# EAGLE design ZamekUSBC (EAGLE 9.5.2)
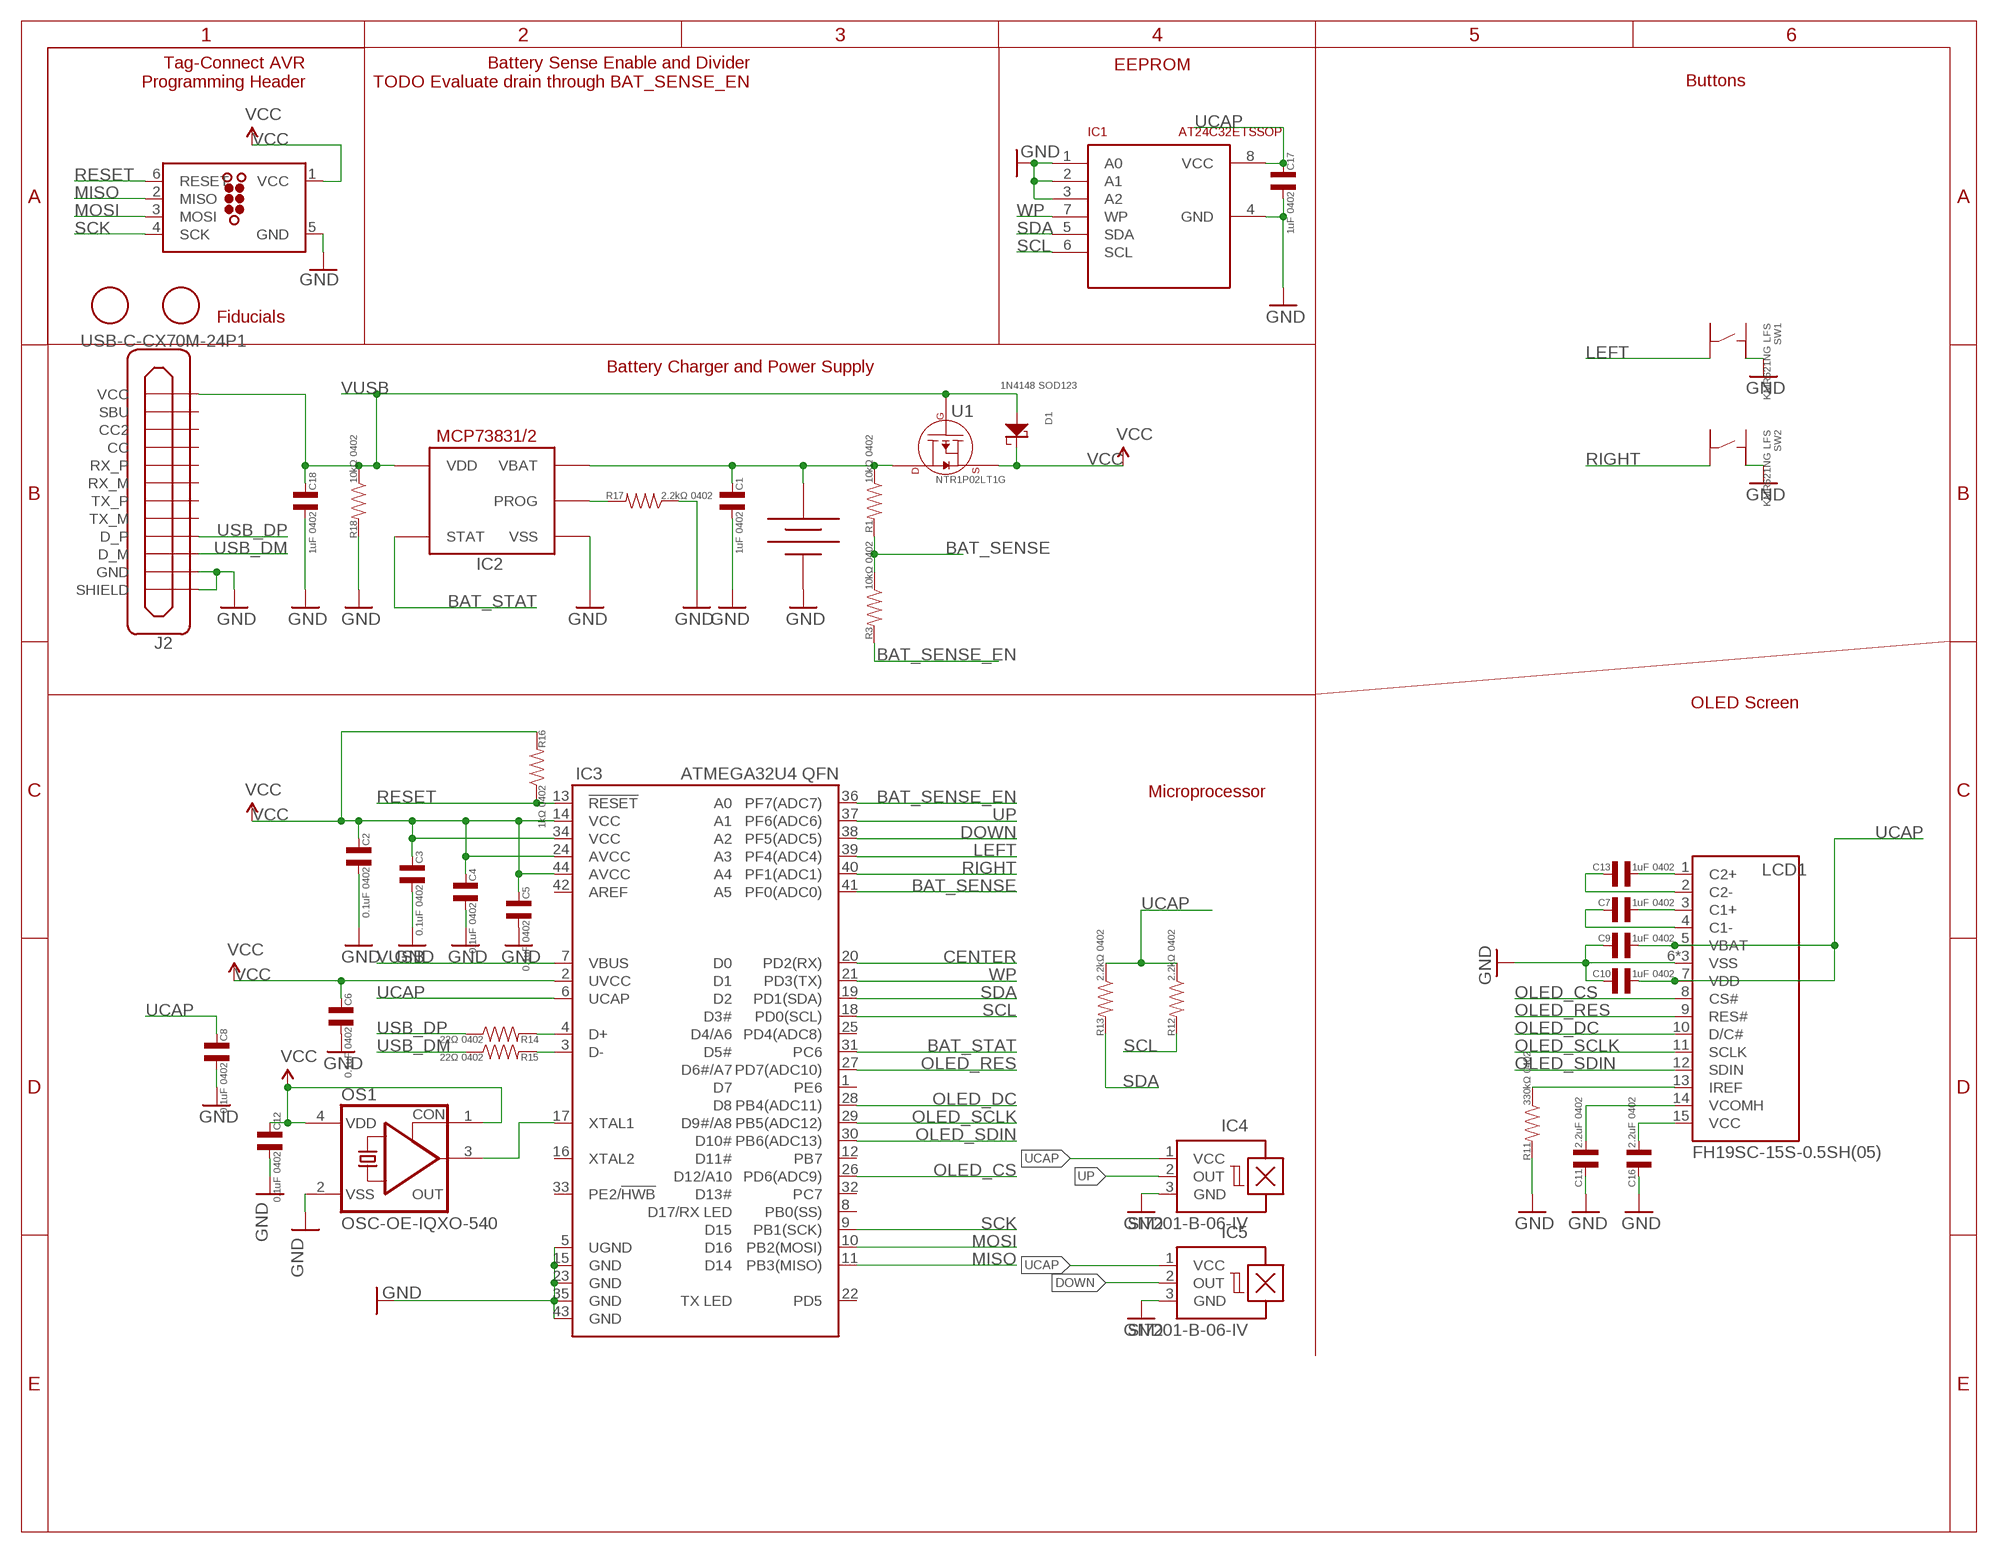
[diagram p0: schematic, sheet 1]

## Parts
BAT1  LIPO201030  [201030LIPO]
C1  1uF 0402  CAPACITOR_NP_0402  [C0402]
C2  0.1uF 0402  CAPACITOR_NP_0402  [C0402]
C3  0.1uF 0402  CAPACITOR_NP_0402  [C0402]
C4  0.1uF 0402  CAPACITOR_NP_0402  [C0402]
C5  0.1uF 0402  CAPACITOR_NP_0402  [C0402]
C6  0.1uF 0402  CAPACITOR_NP_0402  [C0402]
C7  1uF 0402  CAPACITOR_NP_0402  [C0402]
C8  0.1uF 0402  CAPACITOR_NP_0402  [C0402]
C9  1uF 0402  CAPACITOR_NP_0402  [C0402]
C10  1uF 0402  CAPACITOR_NP_0402  [C0402]
C11  2.2uF 0402  CAPACITOR_NP_0402  [C0402]
C12  0.1uF 0402  CAPACITOR_NP_0402  [C0402]
C13  1uF 0402  CAPACITOR_NP_0402  [C0402]
C16  2.2uF 0402  CAPACITOR_NP_0402  [C0402]
C17  1uF 0402  CAPACITOR_NP_0402  [C0402]
C18  1uF 0402  CAPACITOR_NP_0402  [C0402]
D1  1N4148 SOD123  DIODES_SOD-123  [SOD-123]
IC1  AT24C32ETSSOP  [TSSOP8-W]
IC2  MCP73831  MCP73831MF  [MFSOT23-5L]
IC3  ATMEGA32U4 QFN  ATMEGA32U4QFN2  [QFN-44-NOPAD]
IC4  SI7201-B-06-IV  A1202LH  [SOT23-W]
IC5  SI7201-B-06-IV  A1202LH  [SOT23-W]
J1  TC2030-MCP-NLFIX  [TC2030-MCP-NL]
J2  USB-C-CX70M-24P1  [CX70M-24P1]
LCD1  FH19SC-15S-0.5SH(05)  MICROBUILDER_OLED_UG-2832HSWEG04  [ER-OLED0.91-3WWFH19C]
OS1  OSC-OE-IQXO-540  [2.0X1.6-4-PAD]
Q1  FIDUCIAL  [FIDUCIAL_1MM]
Q2  FIDUCIAL  [FIDUCIAL_1MM]
R1  10kΩ 0402  RESISTOR_0402  [R0402]
R3  10kΩ 0402  RESISTOR_0402  [R0402]
R11  330kΩ 0402  RESISTOR_0402  [R0402]
R12  2.2kΩ 0402  RESISTOR_0402  [R0402]
R13  2.2kΩ 0402  RESISTOR_0402  [R0402]
R14  22Ω 0402  RESISTOR_0402  [R0402]
R15  22Ω 0402  RESISTOR_0402  [R0402]
R16  1kΩ 0402  RESISTOR_0402  [R0402]
R17  2.2kΩ 0402  RESISTOR_0402  [R0402]
R18  10kΩ 0402  RESISTOR_0402  [R0402]
SW1  KMR621NG LFS  TACT_4.2MM  [TACT4.2MM]
SW2  KMR621NG LFS  TACT_4.2MM  [TACT4.2MM]
U1  NTR1P02LT1G  P-CHANNEL_FET_SOT-23-3  [SOT-23-3]

## Nets
BAT_SENSE: IC3.41(PF0(ADC0)) R1.P$2 R3.P$1
BAT_SENSE_EN [power]: IC3.36(PF7(ADC7)) R3.P$2
BAT_STAT: IC2.P$1(STAT) IC3.31(PC6)
CENTER: IC3.20(PD2(RX))
DOWN: IC3.38(PF5(ADC5)) IC5.2(OUT)
GND [power]: BAT1.NEG C1.P$1 C2.P$1 C3.P$1 C4.P$1 C5.P$1 C6.P$1 C8.P$1 C9.P$2 C10.P$2 C11.P$2 C12.P$1 C16.P$2 C17.P$1 C18.P$1 IC1.1(A0) IC1.2(A1) IC1.3(A2) IC1.4(GND) IC2.P$2(VSS) IC3.5(UGND) IC3.15(GND) IC3.23(GND) IC3.35(GND) IC3.43(GND) IC4.3(GND) IC5.3(GND) J1.5(GND) J2.A1(GND) J2.A12(GND) J2.B1(GND) J2.B12(GND) J2.SHIELD@1(SHIELD) J2.SHIELD@2(SHIELD) J2.SHIELD@3(SHIELD) J2.SHIELD@4(SHIELD) LCD1.6(VSS) LCD1.EP1(VSS) LCD1.EP2(VSS) OS1.2(VSS) R11.P$2 R17.P$1 R18.P$2 SW1.P$2 SW2.P$2
LEFT: IC3.39(PF4(ADC4)) SW1.P$4
MISO: IC3.11(PB3(MISO)) J1.2(MISO)
MOSI: IC3.10(PB2(MOSI)) J1.3(MOSI)
N$1: C13.P$2 LCD1.2(C2-)
N$2: C7.P$1 LCD1.3(C1+)
N$3: C7.P$2 LCD1.4(C1-)
N$4: C13.P$1 LCD1.1(C2+)
N$5: IC2.P$5(PROG) R17.P$2
N$6: IC3.4(D+) R14.P$2
N$7: IC3.17(XTAL1) OS1.3(OUT)
N$8: LCD1.13(IREF) R11.P$1
N$9: C11.P$1 LCD1.14(VCOMH)
N$10: IC3.3(D-) R15.P$2
N$15: C16.P$1 LCD1.15(VCC)
OLED_CS: IC3.26(PD6(ADC9)) LCD1.8(CS#)
OLED_DC: IC3.28(PB4(ADC11)) LCD1.10(D/C#)
OLED_RES: IC3.27(PD7(ADC10)) LCD1.9(RES#)
OLED_SCLK: IC3.29(PB5(ADC12)) LCD1.11(SCLK)
OLED_SDIN: IC3.30(PB6(ADC13)) LCD1.12(SDIN)
RESET: IC3.13(!RESET) J1.6(RESET) R16.P$1
RIGHT: IC3.40(PF1(ADC1)) SW2.P$4
SCK: IC3.9(PB1(SCK)) J1.4(SCK)
SCL: IC1.6(SCL) IC3.18(PD0(SCL)) R12.P$2
SDA: IC1.5(SDA) IC3.19(PD1(SDA)) R13.P$2
UCAP [power]: C8.P$2 C9.P$1 C10.P$1 C17.P$2 IC1.8(VCC) IC3.6(UCAP) IC4.1(VCC) IC5.1(VCC) LCD1.5(VBAT) LCD1.7(VDD) R12.P$1 R13.P$1
UP: IC3.37(PF6(ADC6)) IC4.2(OUT)
USB_DM: J2.A7(D_M) J2.B7(D_M) R15.P$1
USB_DP: J2.A6(D_P) J2.B6(D_P) R14.P$1
VBAT [power]: BAT1.POS C1.P$2 IC2.P$3(VBAT) R1.P$1 U1.P$3(DRAIN)
VCC [power]: C2.P$2 C3.P$2 C4.P$2 C5.P$2 C6.P$2 C12.P$2 D1.CATHODE IC3.2(UVCC) IC3.14(VCC) IC3.24(AVCC) IC3.34(VCC) IC3.44(AVCC) J1.1(VCC) OS1.1(CON) OS1.4(VDD) R16.P$2 U1.P$2(SOURCE)
VUSB [power]: C18.P$2 D1.ANODE IC2.P$4(VDD) IC3.7(VBUS) J2.A4(VCC) J2.A9(VCC) J2.B4(VCC) J2.B9(VCC) R18.P$1 U1.P$1(GATE)
WP: IC1.7(WP) IC3.21(PD3(TX))
Unconnected: IC3.1(PE6) IC3.8(PB0(SS)) IC3.12(PB7) IC3.16(XTAL2) IC3.22(PD5) IC3.25(PD4(ADC8)) IC3.32(PC7) IC3.33(PE2/!HWB) IC3.42(AREF) J2.A2(TX_P) J2.A3(TX_M) J2.A5(CC) J2.A8(SBU) J2.A10(RX_M) J2.A11(RX_P) J2.B2(TX_P) J2.B3(TX_M) J2.B5(CC2) J2.B8(SBU) J2.B10(RX_M) J2.B11(RX_P) SW1.P$1 SW1.P$3 SW2.P$1 SW2.P$3

## Notes on the sheet
- Tag-Connect AVR
  Programming Header
- Battery Sense Enable and Divider
  TODO Evaluate drain through BAT_SENSE_EN
- EEPROM
- Buttons
- Fiducials
- Battery Charger and Power Supply
- OLED Screen
- Microprocessor

## Library data of the parts
BAT1 = sonik:LIPO201030
C1-C13 C16-C18 = MF_Passives:CAPACITOR_NP: Library: MF_Passives Description: Device for Non-Polarized Capacitors. Manufacture part number (MPN) can be added via Attributes. Check https://factory.macrofab.com/parts for the house parts list.; POPULATE: 1
D1 = MF_Discrete_Semiconductor:DIODES: Library: MF_Discrete_Semiconductor Description: Device for Single Packaged Diodes.; HOUSEPART: NO; POPULATE: 1
IC1 = sonik:AT24C32E
IC2 = adafruit:MCP73831: MCP73831/2 Miniature Single-Cell, Fully Integrated Li-Ion, Li-Polymer Charge Management Controllers. Nice and small simple lipoly charge controller, with adjustable current and status output (LED) http://www.ladyada.net/library/pcb/eaglelibrary.html
IC3 = SparkFun-DigitalIC:ATMEGA32U4: Atmel 44-pin 8-bit Microcontroller with 32KBytes of ISP Flash and USB Controller
IC4 IC5 = allegro:A12*?: Hall-effect bipolar switch Source: http://www.allegromicro.com/en/Products/Part_Numbers/1202/1202.pdf; OC_FARNELL: unknown; OC_NEWARK: unknown
J1 = sonik:TC2030: TAG-CONNECT ICSP Connector Manufacturer: Tag-Connect <http://www.tag-connect.com> Cable for easy In-Circuit Serial Programming. Designed for Microchip ICD2, suitable for many others. Two variants - one "with legs" (for hands-free fit on PCB) and another "without legs" for quick programming. PAD Description 1 MCLR/Vpp 2 Vdd 3 GND 4 PGD (ISPDAT) 5 PGC (ISPCLK) 6 nc (used for LVP) ©2009 ROFA.cz - modified and updated by Robert Darlington ‹rdarlington@gmail.com›
J2 = USB:USB-C
LCD1 = sonik:MICROBUILDER_OLED_UG-2832HSWEG04: 128x32 SPI 0.91" Monochrome OLED Display
OS1 = IQD-Frequency-Products:OSC-OE: OSCILLATOR WITH OE
Q1 Q2 = adafruit:FIDUCIAL: For use by pick and place machines to calibrate the vision/machine, 1mm By microbuilder.eu
R1 R3 R11-R18 = MF_Passives:RESISTOR: Library: MF_Passives Description: Device for Resistors. Manufacture part number (MPN), Voltage, Tolerance, and Wattage Rating can be added via Attributes. Check https://factory.macrofab.com/parts for the house parts list.; POPULATE: 1
SW1 SW2 = MF_Switches:TACT: Library: MF_Switches Description: Device for Tact Switches. Manufacture part number (MFG#) can be added via Attributes.; HOUSEPART: YES; MPN: MF-SW-TACT-4.2MM; POPULATE: 1; URL: https://factory.macrofab.com/part/MF-SW-TACT-4.2MM; VALUE: MF-SW-TACT-4.2MM
U1 = MF_Discrete_Semiconductor:P-CHANNEL_FET: Library: MF_Discrete_Semiconductor Description: Device for Single P-Channel Mosfet. Manufacture part number (MFG#) can be added via Attributes.; HOUSEPART: NO; POPULATE: 1

## Board
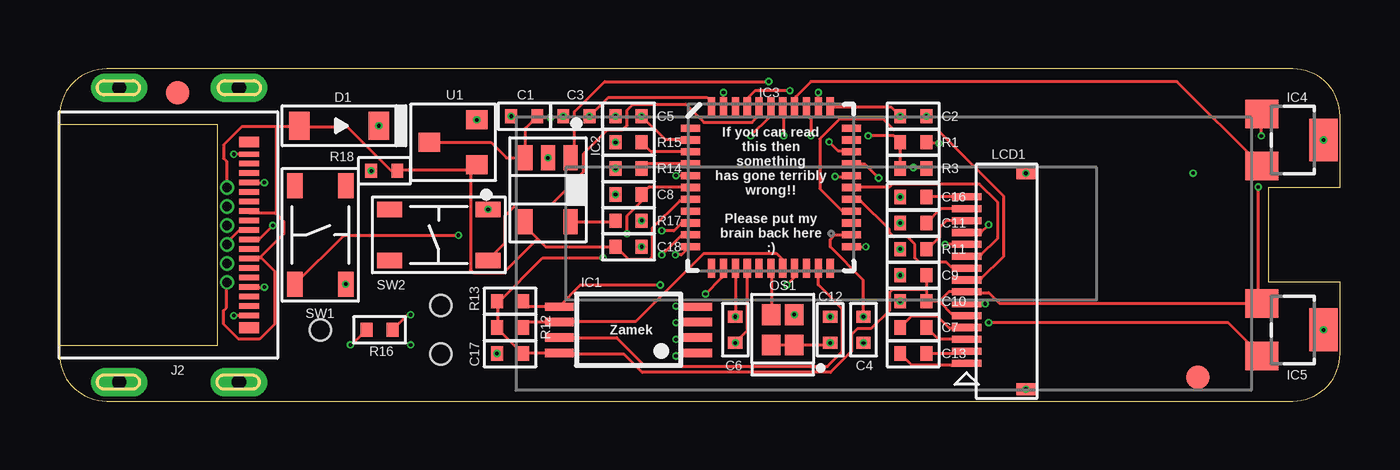
[diagram p1: board, top side]
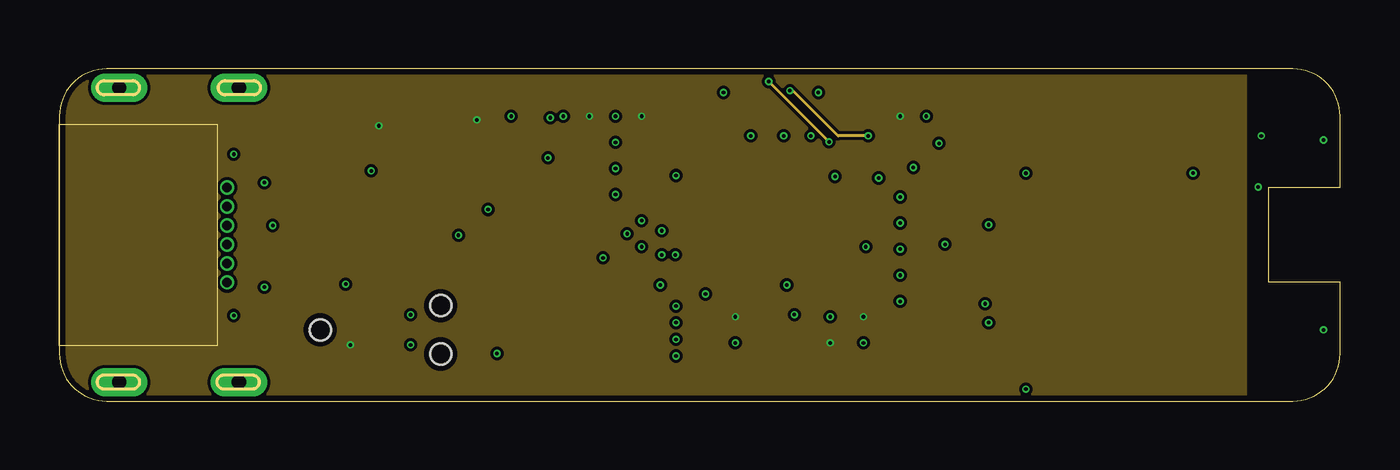
[diagram p2: board, inner layer VCC]
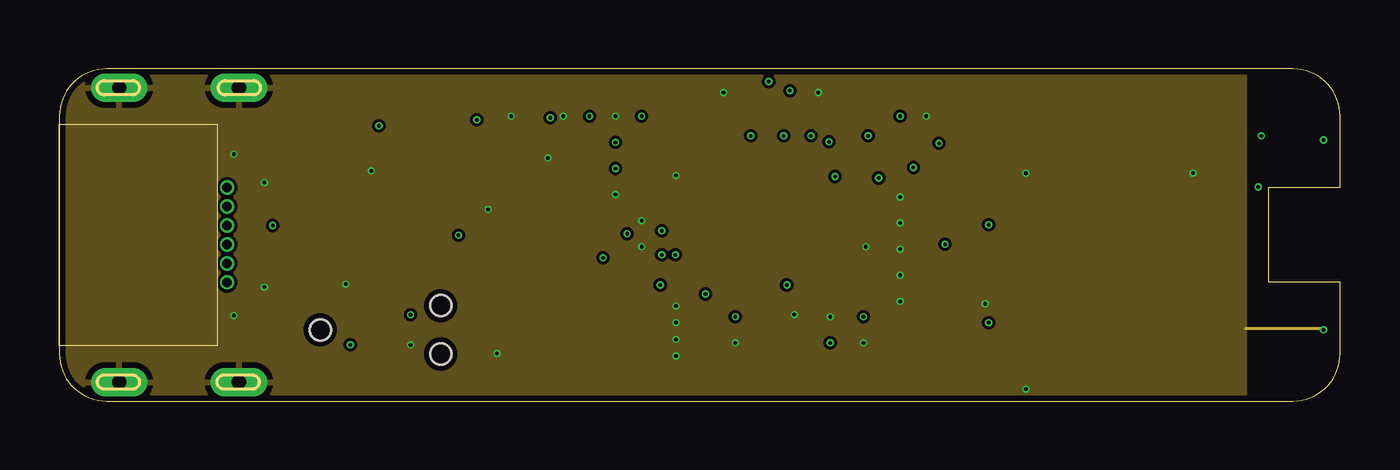
[diagram p3: board, inner layer GND]
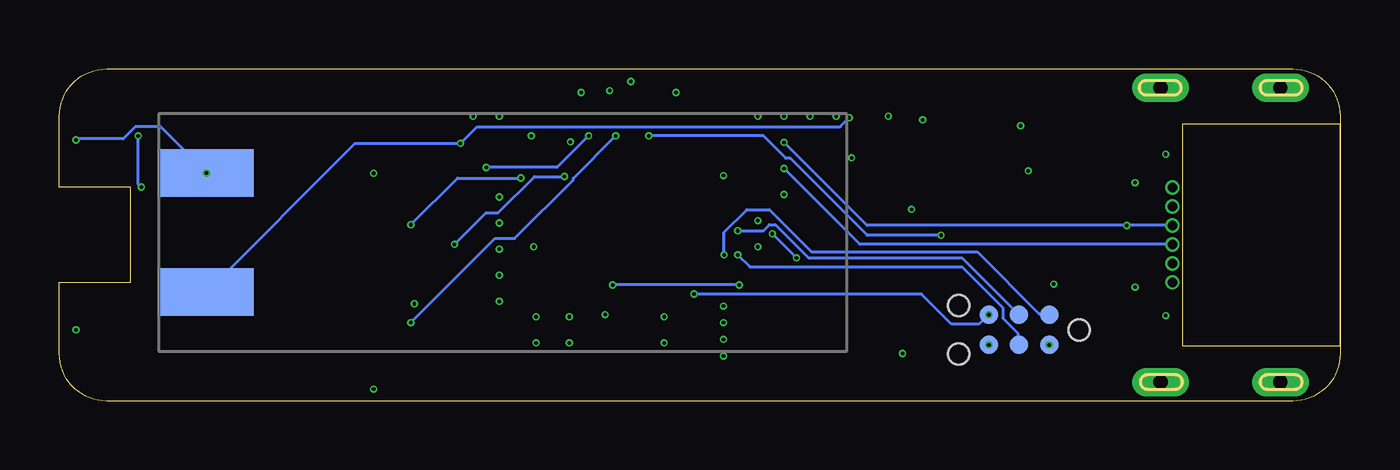
[diagram p4: board, bottom side, seen from below]

Size 54 x 14 mm. Coordinates in mm from the lower left corner, seen from the top.
Outline: 52,14 2,14 arc90 0,12 0,2 arc90 2,0 52,0 arc90 54,2 54,5 51,5 51,9 54,9 54,12 arc90 52,14
Copper layers (1*2*15*16): Top 0.035mm / dielectric 0.23mm / VCC 0.035mm / dielectric 0.93mm / GND 0.035mm / dielectric 0.23mm / Bottom 0.035mm
Design rules "MF_Standard_4_Layer *": minimum track width 5mil, minimum drill 0.15mm, track to track 5mil, track to pad 5mil, pad to pad 5mil, via to via 5mil, smd to smd 0mil, copper to edge 10mil, drill to drill 10mil, minimum pad ring 3mil, minimum via ring 3mil, stop-mask expansion 2mil, vias tented up to drill 25mil, thermal gap 10mil

### Footprints (pad centres in the part's own frame; a part is rotated, then mirrored left to right if it is on the bottom)
201030LIPO = smd 4 x 2: NEG 14,-2.5; POS 14,2.5
C0402 = smd 0.6 x 0.5: P$1 0,-0.55; P$2 0,0.55
SOD-123 = smd 0.85 x 1.2: ANODE 1.675,0; CATHODE -1.675,0
TSSOP8-W = smd 1.2 x 0.35: 1 -2.925,0.975; 2 -2.925,0.325; 3 -2.925,-0.325; 4 -2.925,-0.975; 5 2.925,-0.975; 6 2.925,-0.325; 7 2.925,0.325; 8 2.925,0.975
MFSOT23-5L = smd 1.05 x 0.6: P$1 -1.35,0.95; P$2 -1.35,0; P$3 -1.35,-0.95; P$4 1.35,-0.95; P$5 1.35,0.95
QFN-44-NOPAD = smd 0.8 x 0.3: 1 -3.4,2.5; 2 -3.4,2; 3 -3.4,1.5; 4 -3.4,1; 5 -3.4,0.5; 6 -3.4,0; 7 -3.4,-0.5; 8 -3.4,-1; 9 -3.4,-1.5; 10 -3.4,-2; 11 -3.4,-2.5; 23 3.4,-2.5; 24 3.4,-2; 25 3.4,-1.5; 26 3.4,-1; 27 3.4,-0.5; 28 3.4,0; 29 3.4,0.5; 30 3.4,1; 31 3.4,1.5; 32 3.4,2; 33 3.4,2.5 | smd 0.3 x 0.8: 12 -2.5,-3.4; 13 -2,-3.4; 14 -1.5,-3.4; 15 -1,-3.4; 16 -0.5,-3.4; 17 0,-3.4; 18 0.5,-3.4; 19 1,-3.4; 20 1.5,-3.4; 21 2,-3.4; 22 2.5,-3.4; 34 2.5,3.4; 35 2,3.4; 36 1.5,3.4; 37 1,3.4; 38 0.5,3.4; 39 0,3.4; 40 -0.5,3.4; 41 -1,3.4; 42 -1.5,3.4; 43 -2,3.4; 44 -2.5,3.4
SOT23-W = smd 1.2 x 1.4: 1 -1.1,-1.3; 2 1.1,-1.3 | smd 1.8 x 1.2: 3 0,1.3
TC2030-MCP-NL = smd 0.787 x 0.787: 1 4.73,-0.635; 2 4.73,0.635; 3 3.46,-0.635; 4 3.46,0.635; 5 2.19,-0.635; 6 2.19,0.635 | hole 0.889: 6,0; 0.92,-1.016; 0.92,1.016
CX70M-24P1 = smd 0.23 x 0.85: A1 2.2,-8; A2 1.8,-8; A3 1.4,-8; A4 1,-8; A5 0.6,-8; A6 0.2,-8; A7 -0.2,-8; A8 -0.6,-8; A9 -1,-8; A10 -1.4,-8; A11 -1.8,-8; A12 -2.2,-8; B1 -3.4,-8; B2 -3,-8; B3 -2.6,-8; B10 2.6,-8; B11 3,-8; B12 3.4,-8 | drill 0.4 pad 0.6: B4 -2,-7.075; B5 -1.2,-7.075; B6 -0.4,-7.075; B7 0.4,-7.075; B8 1.2,-7.075; B9 2,-7.075 | smd 0.46 x 0.85: NC@1 -3.915,-8; NC@2 3.915,-8 | drill 0.6 pad 1.2 long: SHIELD@1 6.2,-7.575; SHIELD@2 -6.2,-7.575; SHIELD@3 6.2,-2.525; SHIELD@4 -6.2,-2.525
ER-OLED0.91-3WWFH19C = smd 1.25 x 0.3: 1 3.5,-4.602; 2 3.5,-4.102; 3 3.5,-3.602; 4 3.5,-3.102; 5 3.5,-2.602; 6 3.5,-2.102; 7 3.5,-1.602; 8 3.5,-1.102; 9 3.5,-0.602; 10 3.5,-0.102; 11 3.5,0.402; 12 3.5,0.902; 13 3.5,1.402; 14 3.5,1.902; 15 3.5,2.402 | smd 0.8 x 0.5: EP1 6,3.398; EP2 6,-5.702
2.0X1.6-4-PAD = smd 0.875 x 0.775: 1 -0.637,-0.487; 2 0.637,-0.487; 3 0.637,0.487; 4 -0.637,0.487
FIDUCIAL_1MM = smd 1 x 1: 1 0,0
R0402 = smd 0.5 x 0.6: P$1 -0.55,0; P$2 0.55,0
TACT4.2MM = smd 1.05 x 0.65: P$1 -2.075,1.075; P$2 2.075,1.075; P$3 -2.075,-1.075; P$4 2.075,-1.075
SOT-23-3 = smd 0.9 x 0.8: P$1 -1,0.95; P$2 -1,-0.95; P$3 1,0

### Placement (x,y rotation side)
BAT1  33.8,7.1 180 bottom
C1  19.6,12 270 top
C2  36,12 90 top
C3  21.8,12 270 top
C4  33.9,3 0 top
C5  24,12 270 top
C6  28.5,3 0 top
C7  36,3.1 90 top
C8  24,8.7 270 top
C9  36,5.3 90 top
C10  36,4.2 90 top
C11  36,7.5 90 top
C12  32.5,3 180 top
C13  36,2 270 top
C16  36,8.6 90 top
C17  19,2 270 top
C18  24,6.5 90 top
D1  11.8,11.6 180 top
IC1  24,3 180 top
IC2  20.6,8.9 270 top
IC3  30,9 0 top
IC4  52,11 270 top
IC5  52,3 270 top
J1  17,3 0 bottom
J2  0,7 90 top
LCD1  34.75,6.2 0 top
OS1  30.5,3 90 top
Q1  5,13 0 top
Q2  48,1 0 top
R1  36,10.9 180 top
R3  36,9.8 0 top
R11  36,6.4 180 top
R12  19,3.1 0 top
R13  19,4.2 0 top
R14  24,9.8 0 top
R15  24,10.9 0 top
R16  13.5,3 180 top
R17  24,7.6 180 top
R18  13.7,9.7 180 top
SW1  11,7 270 top
SW2  16,7 0 top
U1  16.6,10.9 180 top

### Tracks (layer width: path | path; a pad name or v marks a point on that pad's centre or on a via)
BAT_SENSE  (via drill 0.15)
  Top 0.127: v30.8,13.08 29.34,13.08 29.02,12.76 29.02,12.45 IC3.41 | v34.1,11.18 35.18,11.18 35.43,10.92 R1.P$2
  Top 0.13: R3.P$1 R1.P$2
  VCC 0.127: v30.8,13.08 30.92,13.08 32.83,11.18 v34.1,11.18
BAT_SENSE_EN  (via drill 0.15)
  Top 0.127: v36.01,9.84 36.51,9.84 R3.P$2 | v31.69,11.18 31.69,11.87 31.56,12 31.56,12.38 IC3.36
  Bottom 0.127: v36.01,9.84 33.02,9.84 v31.69,11.18
BAT_STAT  (via drill 0.15)
  Top 0.127: v32.45,10.92 32.83,10.54 33.34,10.54 IC3.31 | v29.91,13.46 22.99,13.46 21.72,12.19 21.72,10.41 21.59,10.29 IC2.P$1
  VCC 0.127: v29.91,13.46 v32.45,10.92
DOWN  (via drill 0.15)
  Top 0.127: v30.54,11.18 30.54,12.38 IC3.38 | v39.18,3.3 49.28,3.3 50.67,1.91 IC5.2
  Bottom 0.127: v30.54,11.18 32.32,9.4 32.32,9.34 34.8,6.86 35.62,6.86 v39.18,3.3
GND  (via drill 0.15)
  Top 0.127: IC3.15 29.02,5.59 29.02,2.98 28.51,2.48 C6.P$1
  Top 0.13: IC3.43 v28,13 | IC3.35 v32,13 | LCD1.6 v39.03,4.1 | IC3.23 v34,6.5 | IC1.4 26.9,4 v26,4 | IC1.3 26.02,3.33 v26,3.3 | IC1.2 26.07,2.67 v26,2.6 | IC1.1 26.12,2.02 v26,1.9 | IC3.5 v26,9.5 | J2.B1 v7.36,3.6 | J2.A12 v8.64,4.8 | J2.A1 v8.64,9.2 | J2.B12 v7.36,10.4
  GND 0.127: 50,3.05 50.04,3.05 53.28,3.05 IC5.3
  Bottom 0.127: IC4.3 53.28,11.05 51.31,11.05 50.8,11.56 49.72,11.56 47.82,9.65 BAT1.NEG
  other vias: 14.81,2.37 12.07,4.92 18.07,8.07 13.15,9.7 19.05,12 20.6,10.25 21.25,12 23.45,12 35.45,7.5 35.45,8.6 35.45,6.4 35.45,5.3 35.45,4.2 36.55,12 40.75,9.6 40.75,0.5 47.8,9.6 53.3,11 53.3,3 33.9,2.45 32.5,3.55 30.99,3.64 28.5,2.45 18.45,2 24.55,6.5 24.55,7.6 23.45,8.7
  pour GND: 0,14 50,14 50,0 0,0
LEFT  (via drill 0.15)
  Top 0.127: v29.15,11.18 29.97,12 29.97,12.38 IC3.39 | v16.83,6.99 12,6.99 9.97,4.95 SW1.P$4
  Bottom 0.127: v29.15,11.18 24.32,11.18 23.37,10.22 23.18,10.22 19.94,6.99 v16.83,6.99
MISO  (via drill 0.15)
  Top 0.127: v25.97,6.16 26.23,6.16 26.54,6.48 IC3.11
  Bottom 0.127: v25.97,6.16 25.97,7.11 25.02,8.06 24.07,8.06 22.29,6.29 15.3,6.29 12.7,3.68 12.32,3.68 J1.2
MOSI  (via drill 0.15)
  Top 0.127: v25.4,6.16 26.23,6.99 26.54,6.99 IC3.10
  Bottom 0.127: v25.4,6.16 24.89,5.65 15.94,5.65 14.22,3.94 14.22,3.49 13.59,2.86 13.59,2.41 J1.3
N$1
  Top 0.13: LCD1.2 38.15,2 C13.P$2
N$2
  Top 0.13: LCD1.3 37.05,2.6 C7.P$1
N$3
  Top 0.13: C7.P$2 35.95,3.6 37,3.6 37.5,3.1 LCD1.4
N$4
  Top 0.13: LCD1.1 37.7,1.6 37.6,1.5 35.95,1.5 C13.P$1
N$5
  Top 0.127: R17.P$2 23.43,7.56 21.59,7.56 IC2.P$5
N$6
  Top 0.13: IC3.4 24.75,10 R14.P$2
N$7
  Top 0.127: IC3.17 30.04,5.59 30.04,3.68 OS1.3
N$8
  Top 0.13: LCD1.13 37.4,7.6 37.1,7.3 37.1,6.9 36.6,6.4 R11.P$1
N$9
  Top 0.13: LCD1.14 37.15,8.1 C11.P$1
N$10
  Top 0.13: IC3.3 24.95,10.5 R15.P$2
N$15
  Top 0.13: LCD1.15 C16.P$1
OLED_CS
  Top 0.127: IC3.26 33.34,8 33.02,8 32.07,8.95 32.07,11.05 32.89,11.87 34.73,11.87 35.18,11.43 37.02,11.43 39.81,8.64 39.81,6.1 38.86,5.14 38.29,5.14 LCD1.8
OLED_DC
  Top 0.127: IC3.28 33.4,9.02 34.99,9.02 35.12,9.14 38.8,9.14 39.56,8.38 39.56,6.86 38.86,6.16 38.29,6.16 LCD1.10
OLED_RES
  Top 0.127: IC3.27 33.4,8.45 33.78,8.45 34.99,7.24 34.99,7.11 35.18,6.92 35.75,6.92 36.07,6.6 36.07,6.03 36.26,5.84 37.4,5.84 37.59,5.65 38.23,5.65 LCD1.9
OLED_SCLK  (via drill 0.15)
  Top 0.127: v32.7,9.46 33.34,9.46 IC3.29 | v37.34,6.6 38.23,6.6 LCD1.11
  Bottom 0.127: v32.7,9.46 33.97,9.46 35.5,7.94 36.01,7.94 v37.34,6.6
OLED_SDIN  (via drill 0.15)
  Top 0.127: v34.54,9.4 33.97,9.97 33.4,9.97 IC3.30 | v39.18,7.43 38.86,7.11 38.29,7.11 LCD1.12
  Bottom 0.127: v34.54,9.4 37.21,9.4 v39.18,7.43
RESET  (via drill 0.15)
  Top 0.127: v27.24,4.51 27.94,5.21 27.94,5.59 IC3.13
  Top 0.13: J1.6 14.69,3.63 R16.P$1
  Bottom 0.127: v27.24,4.51 17.65,4.51 16.38,3.24 15.24,3.24 14.86,3.62 J1.6
  other vias: 14.81,3.63
RIGHT
  Top 0.127: IC3.40 29.46,12.38 29.46,12 29.21,11.75 27.18,11.75 26.42,12.51 24.19,12.51 23.94,12.26 23.94,11.62 23.75,11.43 23.11,11.43 22.1,10.41 22.1,9.65 20.77,8.32 19.3,8.32 18.8,7.81 18.8,6.67 18.1,5.97 SW2.P$4
SCK  (via drill 0.15)
  Top 0.127: v25.4,7.18 25.91,7.18 26.23,7.49 26.54,7.49 IC3.9
  Bottom 0.127: v25.4,7.18 24.32,7.18 24.07,7.43 23.81,7.43 22.42,6.03 15.94,6.03 13.59,3.68 J1.4
SCL
  Top 0.127: IC3.18 30.48,5.65 30.48,5.97 30.23,6.22 27.18,6.22 24.32,3.37 21.08,3.37 IC1.6
  Top 0.13: IC1.6 19.77,3.33 R12.P$2
SDA  (via drill 0.15)
  Top 0.127: v30.67,4.89 30.99,5.21 30.99,5.59 IC3.19 | v25.34,4.89 21.97,4.89 21.08,4 IC1.5
  Top 0.13: IC1.5 19.77,3.98 R13.P$2
  Bottom 0.127: v25.34,4.89 v30.67,4.89
UCAP  (via drill 0.15)
  Top 0.127: C17.P$2 19.49,2.03 18.48,3.05 R12.P$1 18.48,3.11 18.48,4.19 R13.P$1 18.54,4.19 20.38,6.03 v22.92,6.03 | 50.55,4.13 39.62,4.13 39.18,4.57 38.29,4.57 LCD1.7 | 50.55,4.13 50.67,4.13 IC5.1 50.55,4.13 | v50.67,11.18 50.67,12.06 IC4.1 | 50.55,4.13 v50.55,9.02 | IC1.8 21.08,1.97 23.81,1.97 24.57,1.21 32.51,1.21 33.4,2.1 33.4,2.79 33.66,3.05 34.23,3.05 34.99,3.81 34.99,4.57 35.12,4.7 36.51,4.7 36.55,4.7 | v23.94,7.05 23.94,7.81 24.57,8.45 24.57,8.64 C8.P$2
  Top 0.13: LCD1.5 37.7,3.6 37.1,4.2 | 37.1,4.2 C10.P$1 36.55,4.7 C9.P$1 | LCD1.7 37.5,4.6 37.1,4.2 | C17.P$2 19.57,2.02 IC1.8 | IC3.6 24.85,9 C8.P$2
  Bottom 0.127: v50.67,11.18 50.67,9.14 v50.55,9.02 | v22.92,6.03 v23.94,7.05
UP
  Top 0.127: IC3.37 31.05,12.45 31.05,12.83 31.69,13.46 47.12,13.46 50.67,9.91 IC4.2
USB_DM  (via drill 0.15)
  Top 0.13: J2.A7 8.4,6.79 9,7.39 v9,7.4
  Bottom 0.13: J2.B7 v9,7.4 19.95,7.4 R15.P$1
  other vias: 23.45,10.9
USB_DP  (via drill 0.15)
  Top 0.13: J2.B6 7.08,6.7 7.59,7.2 J2.A6
  Bottom 0.13: J2.B6 20.25,6.6 R14.P$1
  other vias: 23.45,9.8
VBAT  (via drill 0.15)
  Top 0.127: v37.08,10.86 36.58,10.86 R1.P$1 | v20.7,11.94 20.19,11.94 C1.P$2
  Top 0.13: C1.P$2 19.65,11.5 IC2.P$3 18.85,10.25 18.2,10.9 U1.P$3
  Bottom 0.127: BAT1.POS 47.75,4.64 41.53,10.86 v37.08,10.86 36.39,11.56 21.08,11.56 v20.7,11.94
VCC  (via drill 0.15)
  Top 0.13: J1.1 12.31,2.37 R16.P$2 | IC3.2 25.55,11 C5.P$2 | C3.P$2 23.15,12.8 27.3,12.8 27.5,12.6 IC3.44 | IC3.34 35.05,12.4 C2.P$2 | C4.P$2 33.9,5.1 32.5,6.5 32.5,6.8 32.7,7 IC3.24 | OS1.4 OS1.1 32.41,2.36 C12.P$2 | IC3.14 C6.P$2
  other vias: 12.27,2.37 13.47,11.6 17.6,11.85 22.35,12 24.55,12 35.45,12 33.9,3.55 32.5,2.45 28.5,3.55
  pour VCC: 0,14 50,14 50,0 0,0
VUSB
  Top 0.127: 8.48,6.06 9.46,7.05 9.46,7.56 9.11,7.91 | 8.48,6.06 8.45,6.03 8,6.03 J2.A9 | 9.11,7.91 9.08,7.94 8,7.94 J2.A4 | J2.B4 7.05,4.95 7.05,3.94 6.92,3.81 6.92,3.24 7.56,2.6 8.45,2.6 9.08,3.24 9.08,5.46 8.51,6.03 8.48,6.06 | IC3.7 26.54,8.45 26.16,8.45 25.02,7.3 25.02,6.1 24.89,5.97 24,5.97 23.5,6.48 C18.P$2 | 17.34,9.72 17.4,9.72 17.59,9.91 U1.P$1 17.34,9.72 | 17.34,9.72 14.29,9.72 R18.P$1 14.22,9.72 13.97,9.72 12.13,11.56 10.16,11.56 D1.ANODE 10.1,11.56 9.14,11.56 | 9.14,11.56 7.68,11.56 6.92,10.79 6.92,10.22 7.05,10.1 7.05,9.02 J2.B9 | 17.34,9.72 17.34,5.52 17.46,5.4 18.73,5.4 20.13,6.79 20.17,6.83 | 9.14,11.56 9.14,7.94 9.11,7.91
  Top 0.13: IC2.P$4 19.65,7.35 20.17,6.83 20.5,6.5 C18.P$2
WP
  Top 0.127: IC3.21 32,5.59 32,4.89 33.02,3.87 33.02,2.1 32.38,1.46 24.7,1.46 23.5,2.67 21.08,2.67 IC1.7

### Text on the board
tPlace: If you can read / this then / something / has gone terribly / wrong!! / / Please put my / brain back here / :)
tNames: Zamek